# EAGLE design stepper_simple_dual (EAGLE 6.4)
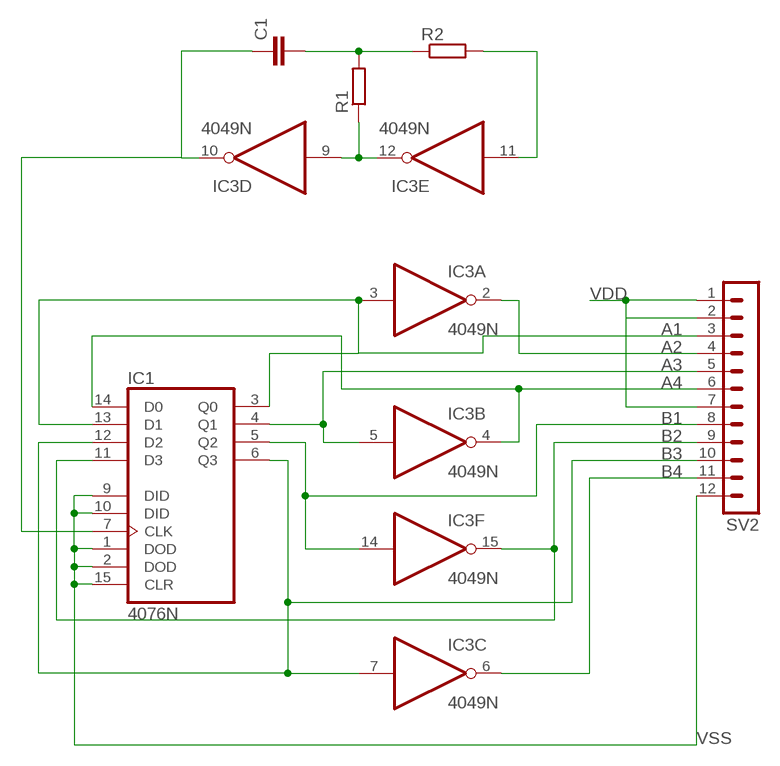
[diagram p0: schematic, sheet 1]

## Parts
C1  C-EU050-024X044  [C050-024X044]
IC1  4076N  [DIL16]
IC3  4049N  [DIL16]
R1  R-EU_0207/10  [0207/10]
R2  R-EU_0207/10  [0207/10]
SV2  MA12-1  [MA12-1]

## Nets
A1: IC1.3(Q0) IC1.13(D1) IC3.3(A:I) SV2.3
A2: IC3.2(A:O) SV2.4
A3: IC1.4(Q1) IC3.5(B:I) SV2.5
A4: IC1.14(D0) IC3.4(B:O) SV2.6
B1: IC1.5(Q2) IC3.14(F:I)
B2: IC1.11(D3) IC3.15(F:O)
B3: IC1.6(Q3) IC1.12(D2) IC3.7(C:I)
B4: IC3.6(C:O)
N$1: IC3.9(D:I) IC3.12(E:O) R1.1
N$2: C1.1 IC1.7(CLK) IC3.10(D:O)
N$3: C1.2 R1.2 R2.1
N$4: IC3.11(E:I) R2.2
VDD: SV2.1 SV2.2 SV2.7
VSS: IC1.1(DOD) IC1.2(DOD) IC1.9(DID) IC1.10(DID) IC1.15(CLR)
Unconnected: SV2.8 SV2.9 SV2.10 SV2.11 SV2.12

## Power pins joined to a net without a drawn wire
VDD: IC1.16(VDD) IC3.1(P:VDD)
VSS: IC1.8(VSS) IC3.8(P:VSS)

## Library data of the parts
C1 = rcl:C-EU: CAPACITOR, European symbol
IC1 = 40xx:4076: Quad D-type REGISTER
IC3 = 40xx:4049: Hex inverting BUFFER
R1 R2 = rcl:R-EU_: RESISTOR, European symbol
SV2 = con-lstb:MA12-1: PIN HEADER; OC_FARNELL: unknown; OC_NEWARK: unknown

## Board
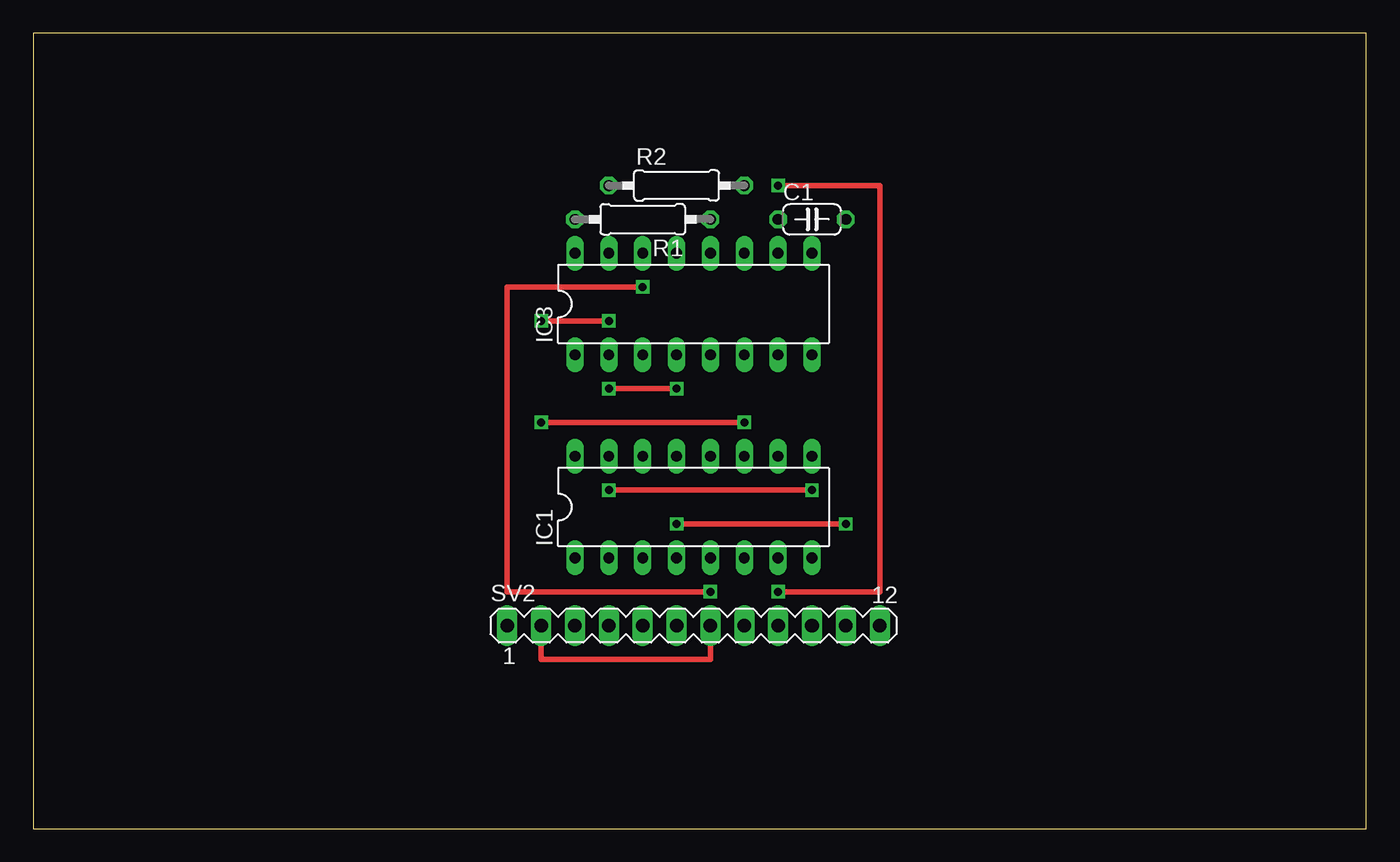
[diagram p1: board, top side]
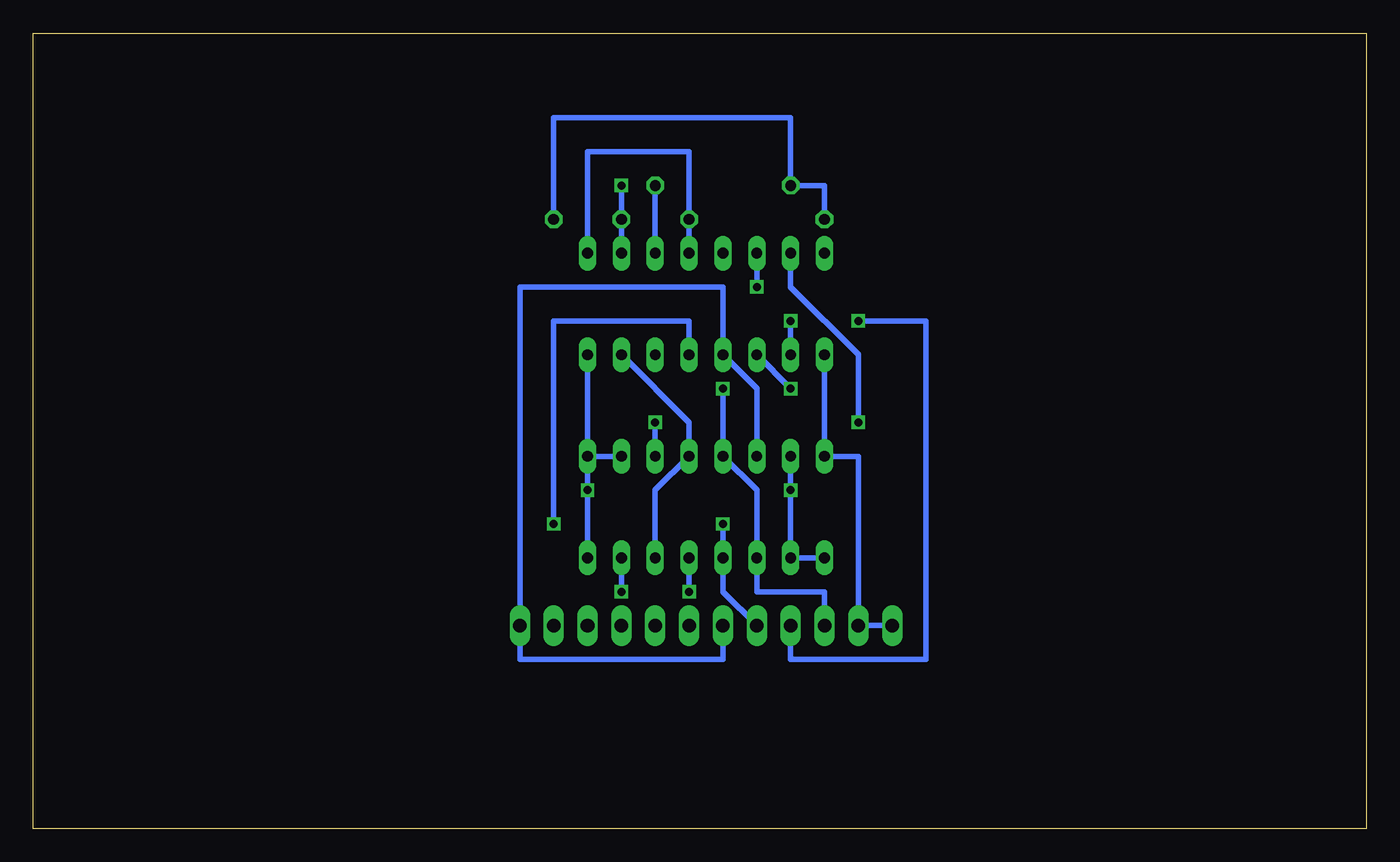
[diagram p2: board, bottom side, seen from below]

Size 100 x 59.68 mm. Coordinates in mm from the lower left corner, seen from the top.
Outline: 0,0 100,0 100,59.68 0,59.68 0,0
Copper layers (1*16): Top 0.035mm / dielectric 1.5mm / Bottom 0.035mm
Design rules "default": minimum track width 10mil, minimum drill 24mil, track to track 8mil, track to pad 8mil, pad to pad 8mil, via to via 8mil, smd to smd 8mil, copper to edge 40mil, drill to drill 8mil, minimum pad ring 10mil, minimum via ring 8mil, stop-mask expansion 4mil, vias tented up to drill 0mil, thermal gap 10mil

### Footprints (pad centres in the part's own frame; a part is rotated, then mirrored left to right if it is on the bottom)
C050-024X044 = drill 0.813 octagon: 1 -2.54,0; 2 2.54,0
DIL16 = drill 0.813 long: 1 -8.89,-3.81; 2 -6.35,-3.81; 3 -3.81,-3.81; 4 -1.27,-3.81; 5 1.27,-3.81; 6 3.81,-3.81; 7 6.35,-3.81; 8 8.89,-3.81; 9 8.89,3.81; 10 6.35,3.81; 11 3.81,3.81; 12 1.27,3.81; 13 -1.27,3.81; 14 -3.81,3.81; 15 -6.35,3.81; 16 -8.89,3.81
0207/10 = drill 0.813 octagon: 1 -5.08,0; 2 5.08,0
MA12-1 = drill 1.016 long: 1 -13.97,0; 2 -11.43,0; 3 -8.89,0; 4 -6.35,0; 5 -3.81,0; 6 -1.27,0; 7 1.27,0; 8 3.81,0; 9 6.35,0; 10 8.89,0; 11 11.43,0; 12 13.97,0

### Placement (x,y rotation side)
C1  58.42,45.72 0 top
IC1  49.53,24.13 0 top
IC3  49.53,39.37 0 top
R1  45.72,45.72 180 top
R2  48.26,48.26 0 top
SV2  49.53,15.24 0 top

### Tracks (layer width: path | path; a pad name or v marks a point on that pad's centre or on a via)
A1  (via drill 0.6)
  Top 0.406: v43.18,33.02 v48.26,33.02
  Bottom 0.406: IC3.3 v43.18,33.02 | v48.26,33.02 IC1.13 45.72,25.4 IC1.3 45.72,17.78 40.64,17.78 SV2.3
A2  (via drill 0.6)
  Top 0.406: v43.18,38.1 v38.1,38.1
  Bottom 0.406: IC3.2 v43.18,38.1 | SV2.4 43.18,12.7 33.02,12.7 33.02,38.1 v38.1,38.1
A3  (via drill 0.6)
  Top 0.406: v60.96,22.86 v48.26,22.86
  Bottom 0.406: IC3.5 50.8,38.1 60.96,38.1 v60.96,22.86 | v48.26,22.86 IC1.4 48.26,17.78 SV2.5
A4
  Bottom 0.406: IC1.14 45.72,33.02 IC3.4 48.26,40.64 63.5,40.64 63.5,12.7 48.26,12.7 SV2.6
B1  (via drill 0.6)
  Top 0.406: v45.72,40.64 35.56,40.64 35.56,17.78 v50.8,17.78
  Bottom 0.406: IC3.14 v45.72,40.64 | v50.8,17.78 IC1.5
B2  (via drill 0.6)
  Top 0.406: v53.34,30.48 v38.1,30.48
  Bottom 0.406: IC1.11 v53.34,30.48 | v38.1,30.48 38.1,35.56 43.18,40.64 IC3.15
B3
  Bottom 0.406: IC1.6 53.34,25.4 IC1.12 50.8,30.48 IC3.7
N$1
  Bottom 0.406: R1.1 IC3.12 50.8,50.8 58.42,50.8 IC3.9
N$2  (via drill 0.6)
  Top 0.406: v55.88,48.26 63.5,48.26 63.5,17.78 v55.88,17.78
  Bottom 0.406: v55.88,48.26 C1.1 IC3.10 | v55.88,17.78 IC1.7
N$3
  Bottom 0.406: C1.2 60.96,53.34 43.18,53.34 R2.1 40.64,48.26 R1.2
N$4
  Bottom 0.406: R2.2 IC3.11
VDD
  Top 0.406: SV2.2 38.1,12.7 50.8,12.7 SV2.7
  Bottom 0.406: SV2.1 SV2.2 38.1,27.94 IC1.16 IC3.1
VSS  (via drill 0.6)
  Top 0.406: v43.18,25.4 v58.42,25.4
  Bottom 0.406: IC1.1 IC1.2 v43.18,25.4 IC1.15 | IC1.9 IC1.10 | IC1.9 v58.42,25.4 IC1.8 | IC3.8 IC1.9